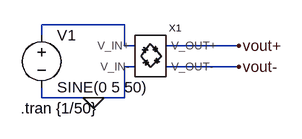
[diagram p0: schematic Act puente de diodos.asc]
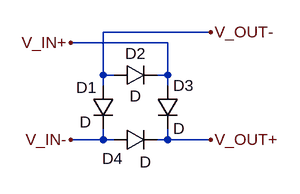
[diagram p1: sub-circuit puente.asc]
Act puente de diodos.asc, the LTspice schematic file:
Version 4
SHEET 1 880 680
WIRE 112 80 -16 80
WIRE -16 96 -16 80
WIRE 112 112 112 80
WIRE 128 112 112 112
WIRE 288 112 176 112
WIRE 128 144 112 144
WIRE 288 144 176 144
WIRE -16 192 -16 176
WIRE 64 192 -16 192
WIRE 112 192 112 144
WIRE 112 192 64 192
FLAG 288 112 vout+
FLAG 288 144 vout-
FLAG 64 192 0
SYMBOL voltage -16 80 R0
WINDOW 123 0 0 Left 0
WINDOW 39 0 0 Left 0
SYMATTR InstName V1
SYMATTR Value SINE(0 5 50)
SYMBOL puente 144 128 R0
SYMATTR InstName X1
TEXT -48 208 Left 2 !.tran {1/50}

puente.asc, the sub-circuit schematic file:
Version 4
SHEET 1 880 680
WIRE 256 16 96 16
WIRE 192 32 48 32
WIRE 96 80 96 16
WIRE 112 80 96 80
WIRE 192 80 192 32
WIRE 192 80 176 80
WIRE 96 96 96 80
WIRE 192 96 192 80
WIRE 96 176 96 160
WIRE 96 176 48 176
WIRE 112 176 96 176
WIRE 192 176 192 160
WIRE 192 176 176 176
WIRE 256 176 192 176
FLAG 48 32 V_IN+
FLAG 48 176 V_IN-
FLAG 256 176 V_OUT+
FLAG 256 16 V_OUT-
SYMBOL diode 112 96 R270
WINDOW 0 32 32 VTop 2
WINDOW 3 0 32 VBottom 2
SYMATTR InstName D2
SYMBOL diode 176 96 R0
SYMATTR InstName D3
SYMBOL diode 112 192 R270
WINDOW 0 -28 -2 VTop 2
WINDOW 3 -2 47 VBottom 2
SYMATTR InstName D4
SYMBOL diode 80 96 R0
WINDOW 0 -24 3 Left 2
WINDOW 3 -19 54 Left 2
SYMATTR InstName D1

The netlist it stands for:
* Act puente de diodos.asc
V1 N001 0 SINE(0 5 50)
XX1 N001 0 vout+ vout- puente

* block symbol definitions
.subckt puente V_IN+ V_IN- V_OUT+ V_OUT-
D2 V_OUT- V_IN+ D
D3 V_IN+ V_OUT+ D
D4 V_IN- V_OUT+ D
D1 V_OUT- V_IN- D
.ends puente

.model D D
.lib standard.dio
.tran {1/50}
.backanno
.end